# EAGLE schematic controller_board (EAGLE 7.6.0)
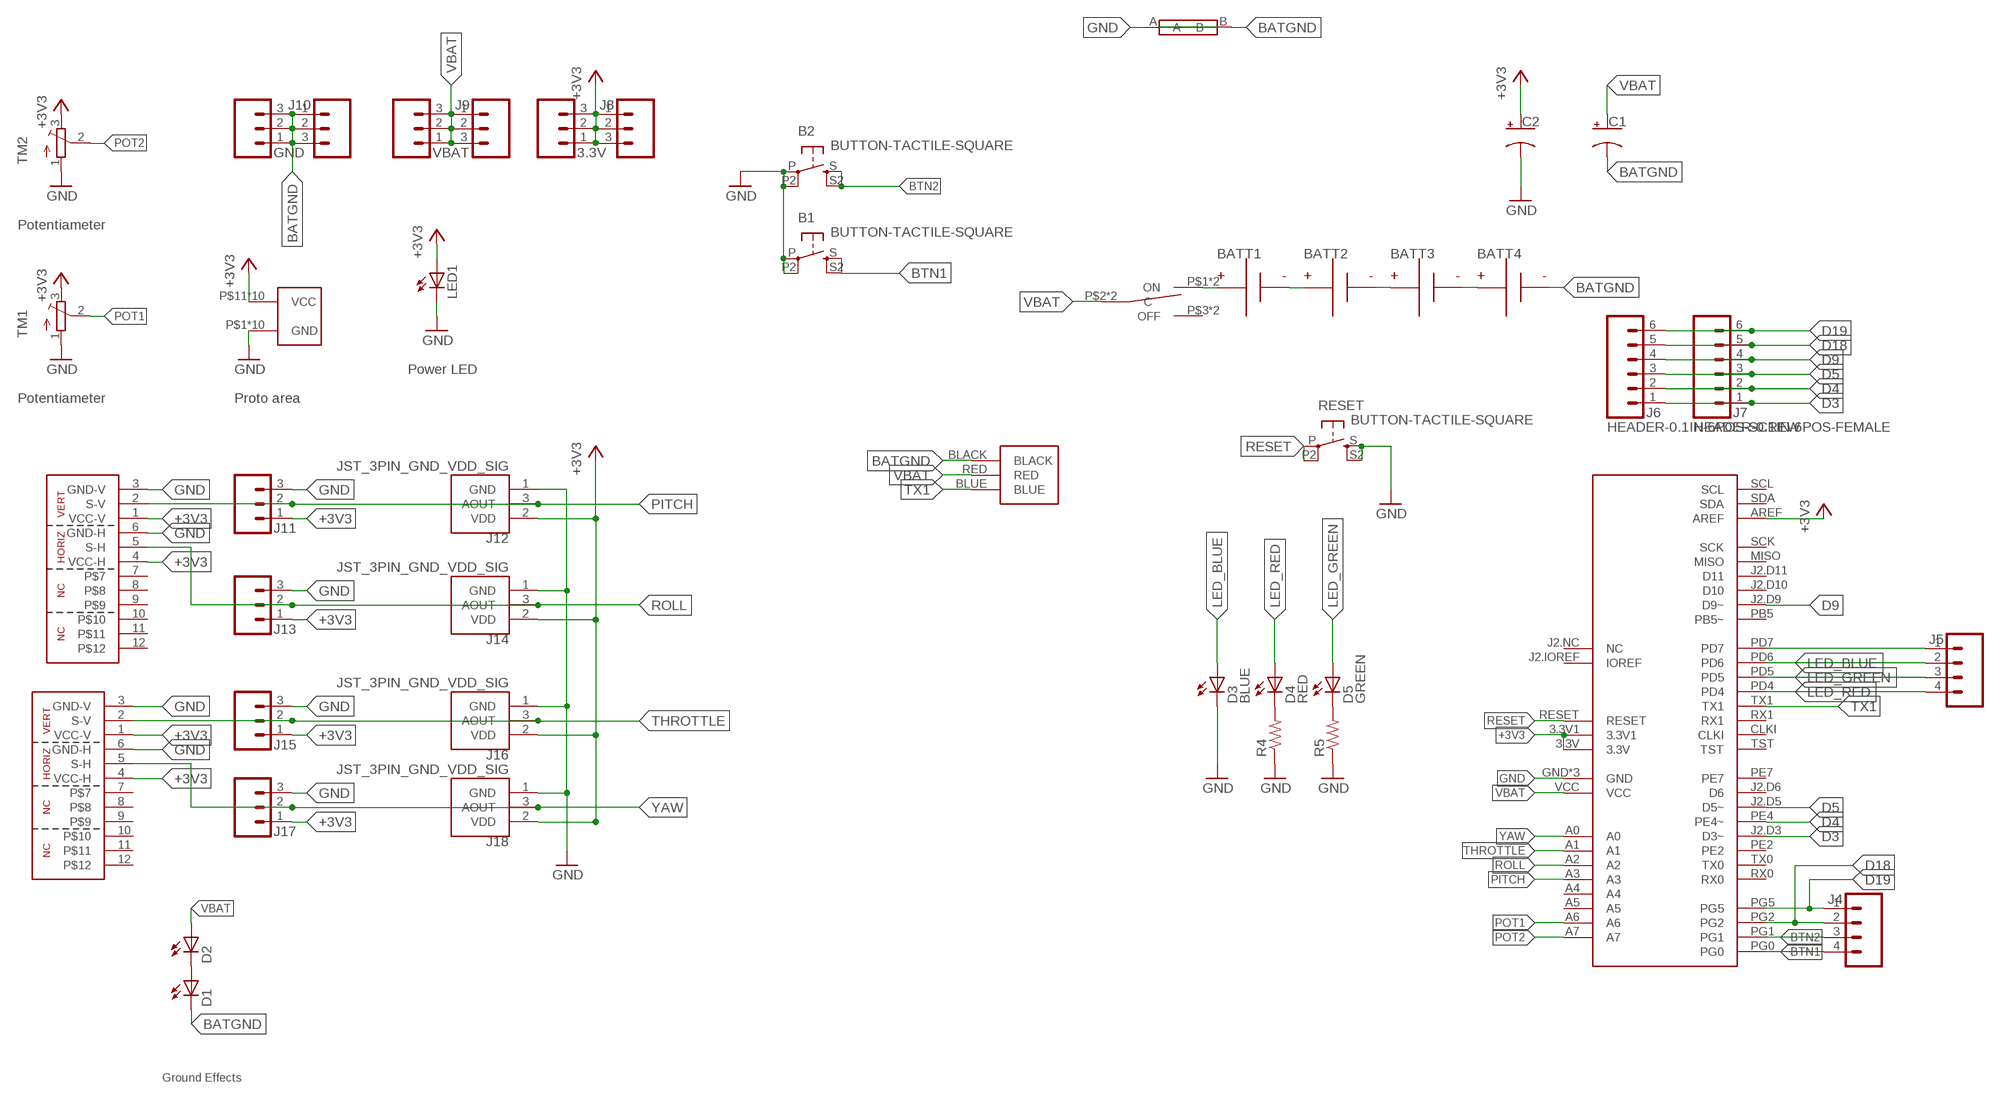
[diagram p0: schematic, sheet 1]

## Parts
3.3V  HEADER-0.1IN-3POS-SCREW  [SCREW-TERMINAL-1X3-2.54MM]
B1  BUTTON-TACTILE-SQUARE  [BUTTON-TACTILE-SQUARE-ADAFRUIT1010]
B2  BUTTON-TACTILE-SQUARE  [BUTTON-TACTILE-SQUARE-ADAFRUIT1010]
BATT1  BATTERY-AA-CLIP  [BATTERY-AA-BK-92]
BATT2  BATTERY-AA-CLIP  [BATTERY-AA-BK-92]
BATT3  BATTERY-AA-CLIP  [BATTERY-AA-BK-92]
BATT4  BATTERY-AA-CLIP  [BATTERY-AA-BK-92]
C1  RESOLVED-CAPACITOR-POL_TH-RADIAL_ALUMINUM_18MM  [CAPPRD750W80D1800H2200P]
C2  RESOLVED-CAPACITOR-POL_TH-RADIAL_ALUMINUM_6.3MM  [CAPPRD250W80D630H1220P]
D1  LED3MM  [LED3MM]
D2  LED3MM  [LED3MM]
D3  BLUE  LED3MM  [LED3MM]
D4  RED  LED3MM  [LED3MM]
D5  GREEN  LED3MM  [LED3MM]
F1  SHORT  [SHORT]
GND  HEADER-0.1IN-3POS-SCREW  [SCREW-TERMINAL-1X3-2.54MM]
J1  FRSKY-GIMBAL  [JST-13-PTH]
J2  FRSKY-GIMBAL  [JST-13-PTH]
J3  WIRE-HARNESS-SPARKFUN-9915  [WIRE-HARNESS-SPARKFUN-9915]
J4  HEADER-0.1IN-4POS-FEMALE  [HDRV4W63P254_4X1_1016X254H838_HS]
J5  HEADER-0.1IN-4POS-FEMALE  [HDRV4W63P254_4X1_1016X254H838_HS]
J6  HEADER-0.1IN-6POS-SCREW  [SCREW-TERMINAL-1X6-2.54MM]
J7  HEADER-0.1IN-6POS-FEMALE  [HDRV6W63P254_6X1_1524X254H838_HS]
J8  HEADER-0.1IN-3POS-FEMALE  [HDRV3W63P254_3X1_762X254H838_HS]
J9  HEADER-0.1IN-3POS-FEMALE  [HDRV3W63P254_3X1_762X254H838_HS]
J10  HEADER-0.1IN-3POS-FEMALE  [HDRV3W63P254_3X1_762X254H838_HS]
J11  HEADER-0.1IN-3POS-SCREW  [SCREW-TERMINAL-1X3-2.54MM]
J12  JST_3PIN_GND_VDD_SIG  [JST-3-PTH-REVERSE]
J13  HEADER-0.1IN-3POS-SCREW  [SCREW-TERMINAL-1X3-2.54MM]
J14  JST_3PIN_GND_VDD_SIG  [JST-3-PTH-REVERSE]
J15  HEADER-0.1IN-3POS-SCREW  [SCREW-TERMINAL-1X3-2.54MM]
J16  JST_3PIN_GND_VDD_SIG  [JST-3-PTH-REVERSE]
J17  HEADER-0.1IN-3POS-SCREW  [SCREW-TERMINAL-1X3-2.54MM]
J18  JST_3PIN_GND_VDD_SIG  [JST-3-PTH-REVERSE]
LED1  LED-5MM-RED  [LED5MM]
R4  RESOLVED-RESISTOR_TH-1/6W-CARBON  [RESAD770W45L370D210_HS]
R5  RESOLVED-RESISTOR_TH-1/6W-CARBON  [RESAD770W45L370D210_HS]
RESET  BUTTON-TACTILE-SQUARE  [BUTTON-TACTILE-SQUARE-ADAFRUIT1010]
S1  POWER-SWITCH-MFS201N-9-Z  [POWER-SWITCH-MFS201N-9-Z]
TM1  TRIMPOT3386  [TRIM-3386]
TM2  TRIMPOT3386  [TRIM-3386]
U$3  PROTO-AREA-10X10  [PROTO-AREA-10X10]
U$4  ATMEGA128RFA1-BOB  [ATMEGA128RFA1]
VBAT  HEADER-0.1IN-3POS-SCREW  [SCREW-TERMINAL-1X3-2.54MM]

## Nets
+3V3: 3.3V.1 3.3V.2 3.3V.3 C2.1(+) J1.1(VCC-V) J1.4(VCC-H) J2.1(VCC-V) J2.4(VCC-H) J8.1 J8.2 J8.3 J11.1 J12.2(VDD) J13.1 J14.2(VDD) J15.1 J16.2(VDD) J17.1 J18.2(VDD) LED1.A TM1.3(E) TM2.3(E) U$3.P$11(VCC) U$3.P$12(VCC) U$3.P$13(VCC) U$3.P$14(VCC) U$3.P$15(VCC) U$3.P$16(VCC) U$3.P$17(VCC) U$3.P$18(VCC) U$3.P$19(VCC) U$3.P$20(VCC) U$4.3.3V U$4.3.3V1 U$4.AREF
BATGND [HIGH-I]: BATT4.N1(N) BATT4.N2(N) C1.2(-) D1.K(C) F1.B GND.1 GND.2 GND.3 J3.BLACK J10.1 J10.2 J10.3
BTN1: B1.S B1.S2(S1) J4.4 U$4.PG0
BTN2: B2.S B2.S2(S1) J4.3 U$4.PG1
D3: J6.1 J7.1 U$4.J2.D3(D3~)
D4: J6.2 J7.2 U$4.PE4(PE4~)
D5: J6.3 J7.3 U$4.J2.D5(D5~)
D9: J6.4 J7.4 U$4.J2.D9(D9~)
D18: J4.2 J6.5 J7.5 U$4.PG2
D19: J4.1 J6.6 J7.6 U$4.PG5
GND: B1.P B1.P2(P1) B2.P B2.P2(P1) C2.2(-) D3.K(C) F1.A J1.3(GND-V) J1.6(GND-H) J2.3(GND-V) J2.6(GND-H) J11.3 J12.1(GND) J13.3 J14.1(GND) J15.3 J16.1(GND) J17.3 J18.1(GND) LED1.K(C) R4.1 R5.1 RESET.S RESET.S2(S1) TM1.1(A) TM2.1(A) U$3.P$1(GND) U$3.P$2(GND) U$3.P$3(GND) U$3.P$4(GND) U$3.P$5(GND) U$3.P$6(GND) U$3.P$7(GND) U$3.P$8(GND) U$3.P$9(GND) U$3.P$10(GND) U$4.GND U$4.GND1(GND) U$4.GND2(GND)
LED_BLUE: D3.A J5.2 U$4.PD6
LED_GREEN: D5.A J5.3 U$4.PD5
LED_RED: D4.A J5.4 U$4.PD4
N$1 [HIGH-I]: BATT1.N1(N) BATT1.N2(N) BATT2.P1(P) BATT2.P2(P)
N$2 [HIGH-I]: BATT2.N1(N) BATT2.N2(N) BATT3.P1(P) BATT3.P2(P)
N$3 [HIGH-I]: BATT3.N1(N) BATT3.N2(N) BATT4.P1(P) BATT4.P2(P)
N$4: D4.K(C) R4.2
N$5 [HIGH-I]: BATT1.P1(P) BATT1.P2(P) S1.P$1(ON) S1.P$4(ON)
N$6: D5.K(C) R5.2
N$9: J5.1 U$4.PD7
N$13: D1.A D2.K(C)
PITCH: J1.2(S-V) J11.2 J12.3(AOUT) U$4.A3
POT1: TM1.2(S) U$4.A6
POT2: TM2.2(S) U$4.A7
RESET: RESET.P RESET.P2(P1) U$4.RESET
ROLL: J1.5(S-H) J13.2 J14.3(AOUT) U$4.A2
THROTTLE: J2.2(S-V) J15.2 J16.3(AOUT) U$4.A1
TX1: J3.BLUE U$4.TX1
VBAT [HIGH-I]: C1.1(+) D2.A J3.RED J9.1 J9.2 J9.3 S1.P$2(C) S1.P$5(C) U$4.VCC VBAT.1 VBAT.2 VBAT.3
YAW: J2.5(S-H) J17.2 J18.3(AOUT) U$4.A0
Unconnected: J1.7 J1.8 J1.9 J1.10 J1.11 J1.12 J2.7 J2.8 J2.9 J2.10 J2.11 J2.12 S1.P$3(OFF) S1.P$6(OFF) U$4.A4 U$4.A5 U$4.CLKI U$4.J2.D6(D6) U$4.J2.D10(D10) U$4.J2.D11(D11) U$4.J2.IOREF(IOREF) U$4.J2.NC(NC) U$4.MISO U$4.PB5(PB5~) U$4.PE2 U$4.PE7 U$4.RX0 U$4.RX1 U$4.SCK U$4.SCL U$4.SDA U$4.TST U$4.TX0

## Notes on the sheet
- Potentiameter
- Power LED
- Potentiameter | Proto area
- Ground Effects

## Library data of the parts
3.3V GND VBAT = Components:HEADER-0.1IN-3POS: 3 pin single inline pin header, socket, or connector; DIST: digikey; DISTPN: ED10562-ND
B1 B2 RESET = Controller:BUTTON-TACTILE; DIST: ADAFRUIT; DISTPN: 1010; MISC: temp
BATT1-BATT4 = Components:BATTERY; DIST: Digikey; DISTPN: BK-92-ND; QTY: 2; ROUGH_HEIGHT: 16
C1 = KoalaBuild:RESOLVED-CAPACITOR-POL_: Polarized capacitor; DIST: Digikey; DISTPN: P5158-ND
C2 = KoalaBuild:RESOLVED-CAPACITOR-POL_: Polarized capacitor; DIST: Digikey; DISTPN: P5152-ND
D1-D3 = Components:LED: LED OSRAM: - CHIPLED LG R971, LG N971, LY N971, LG Q971, LY Q971, LO R971, LY R971 LH N974, LH R974 LS Q976, LO Q976, LY Q976 LO Q996 - Hyper CHIPLED LW Q18S LB Q993, LB Q99A, LB R99A - SideLED LS A670, LO A670, LY A670, LG A670, LP A670 LB A673, LV A673, LT A673, LW A673 LH A674 LY A675 LS A676, LA A676, LO A676, LY A676, LW A676 LS A679, LY A679, LG A679 - Hyper Micro SIDELED® LS Y876, LA Y876, LO Y876, LY Y876 LT Y87S - SmartLED LW L88C, LW L88S LB L89C, LB L89S, LG L890 LS L89K, LO L89K, LY L89K LS L896, LA L896, LO L896, LY L896 - TOPLED LS T670, LO T670, LY T670, LG T670, LP T670 LSG T670, LSP T670, LSY T670, LOP T670, LYG T670 LG T671, LOG T671, LSG T671 LB T673, LV T673, LT T673, LW T673 LH T674 LS T676, LA T676, LO T676, LY T676, LB T676, LH T676, LSB T676, LW T676 LB T67C, LV T67C, LT T67C, LS T67K, LO T67K, LY T67K, LW E67C LS E67B, LA E67B, LO E67B, LY E67B, LB E67C, LV E67C, LT E67C LW T67C LS T679, LY T679, LG T679 LS T770, LO T770, LY T770, LG T770, LP T770 LB T773, LV T773, LT T773, LW T773 LH T774 LS E675, LA E675, LY E675, LS T675 LS T776, LA T776, LO T776, LY T776, LB T776 LHGB T686 LT T68C, LB T68C - Hyper Mini TOPLED® LB M676 - Mini TOPLED Santana® LG M470 LS M47K, LO M47K, LY M47K Source: http://www.osram.convergy.de/; DIST: Adafruit; DISTPN: 780
D4 = Components:LED: LED OSRAM: - CHIPLED LG R971, LG N971, LY N971, LG Q971, LY Q971, LO R971, LY R971 LH N974, LH R974 LS Q976, LO Q976, LY Q976 LO Q996 - Hyper CHIPLED LW Q18S LB Q993, LB Q99A, LB R99A - SideLED LS A670, LO A670, LY A670, LG A670, LP A670 LB A673, LV A673, LT A673, LW A673 LH A674 LY A675 LS A676, LA A676, LO A676, LY A676, LW A676 LS A679, LY A679, LG A679 - Hyper Micro SIDELED® LS Y876, LA Y876, LO Y876, LY Y876 LT Y87S - SmartLED LW L88C, LW L88S LB L89C, LB L89S, LG L890 LS L89K, LO L89K, LY L89K LS L896, LA L896, LO L896, LY L896 - TOPLED LS T670, LO T670, LY T670, LG T670, LP T670 LSG T670, LSP T670, LSY T670, LOP T670, LYG T670 LG T671, LOG T671, LSG T671 LB T673, LV T673, LT T673, LW T673 LH T674 LS T676, LA T676, LO T676, LY T676, LB T676, LH T676, LSB T676, LW T676 LB T67C, LV T67C, LT T67C, LS T67K, LO T67K, LY T67K, LW E67C LS E67B, LA E67B, LO E67B, LY E67B, LB E67C, LV E67C, LT E67C LW T67C LS T679, LY T679, LG T679 LS T770, LO T770, LY T770, LG T770, LP T770 LB T773, LV T773, LT T773, LW T773 LH T774 LS E675, LA E675, LY E675, LS T675 LS T776, LA T776, LO T776, LY T776, LB T776 LHGB T686 LT T68C, LB T68C - Hyper Mini TOPLED® LB M676 - Mini TOPLED Santana® LG M470 LS M47K, LO M47K, LY M47K Source: http://www.osram.convergy.de/; DIST: Adafruit; DISTPN: 777
D5 = Components:LED: LED OSRAM: - CHIPLED LG R971, LG N971, LY N971, LG Q971, LY Q971, LO R971, LY R971 LH N974, LH R974 LS Q976, LO Q976, LY Q976 LO Q996 - Hyper CHIPLED LW Q18S LB Q993, LB Q99A, LB R99A - SideLED LS A670, LO A670, LY A670, LG A670, LP A670 LB A673, LV A673, LT A673, LW A673 LH A674 LY A675 LS A676, LA A676, LO A676, LY A676, LW A676 LS A679, LY A679, LG A679 - Hyper Micro SIDELED® LS Y876, LA Y876, LO Y876, LY Y876 LT Y87S - SmartLED LW L88C, LW L88S LB L89C, LB L89S, LG L890 LS L89K, LO L89K, LY L89K LS L896, LA L896, LO L896, LY L896 - TOPLED LS T670, LO T670, LY T670, LG T670, LP T670 LSG T670, LSP T670, LSY T670, LOP T670, LYG T670 LG T671, LOG T671, LSG T671 LB T673, LV T673, LT T673, LW T673 LH T674 LS T676, LA T676, LO T676, LY T676, LB T676, LH T676, LSB T676, LW T676 LB T67C, LV T67C, LT T67C, LS T67K, LO T67K, LY T67K, LW E67C LS E67B, LA E67B, LO E67B, LY E67B, LB E67C, LV E67C, LT E67C LW T67C LS T679, LY T679, LG T679 LS T770, LO T770, LY T770, LG T770, LP T770 LB T773, LV T773, LT T773, LW T773 LH T774 LS E675, LA E675, LY E675, LS T675 LS T776, LA T776, LO T776, LY T776, LB T776 LHGB T686 LT T68C, LB T68C - Hyper Mini TOPLED® LB M676 - Mini TOPLED Santana® LG M470 LS M47K, LO M47K, LY M47K Source: http://www.osram.convergy.de/; DIST: Adafruit; DISTPN: 779
F1 = RemoteParts:SHORT
J1 = RemoteParts:FRSKY-GIMBAL; CH1: PITCH; CH2: ROLL; DIST: Digikey; DISTPN: A100106-ND
J2 = RemoteParts:FRSKY-GIMBAL; CH1: THR; CH2: YAW; DIST: Digikey; DISTPN: A100106-ND
J3 = RemoteParts:WIRE-HARNESS-SPARKFUN-9915; DIST: Sparkfun; DISTPN: 9915
J4 J5 = Components:HEADER-0.1IN-4POS: 4 pin single inline pin header, socket, or connector; DIST: Digikey; DISTPN: S7002-ND
J6 = Components:HEADER-0.1IN-6POS: 6 pin single inline pin header, socket, or connector; DIST: Digikey; DISTPN: ED10565-ND; PIN1: D3; PIN2: D4; PIN3: D5; PIN4: D9; PIN5: D18; PIN6: D19
J7 = Components:HEADER-0.1IN-6POS: 6 pin single inline pin header, socket, or connector; DIST: MISSING; DISTPN: MISSING
J8-J10 = Components:HEADER-0.1IN-3POS: 3 pin single inline pin header, socket, or connector; DIST: Digikey; DISTPN: S7002-ND; PIN1: 1; PIN2: 2; PIN3: 3
J11 J13 J15 J17 = Components:HEADER-0.1IN-3POS: 3 pin single inline pin header, socket, or connector; DIST: digikey; DISTPN: ED10562-ND; PIN1: +; PIN2: A; PIN3: -
J12 J14 J16 J18 = RemoteParts:JST_3PIN_GND_VDD_SIG; DIST: DIGIKEY; DISTPN: A100097-ND
LED1 = Components:LED: LED OSRAM: - CHIPLED LG R971, LG N971, LY N971, LG Q971, LY Q971, LO R971, LY R971 LH N974, LH R974 LS Q976, LO Q976, LY Q976 LO Q996 - Hyper CHIPLED LW Q18S LB Q993, LB Q99A, LB R99A - SideLED LS A670, LO A670, LY A670, LG A670, LP A670 LB A673, LV A673, LT A673, LW A673 LH A674 LY A675 LS A676, LA A676, LO A676, LY A676, LW A676 LS A679, LY A679, LG A679 - Hyper Micro SIDELED® LS Y876, LA Y876, LO Y876, LY Y876 LT Y87S - SmartLED LW L88C, LW L88S LB L89C, LB L89S, LG L890 LS L89K, LO L89K, LY L89K LS L896, LA L896, LO L896, LY L896 - TOPLED LS T670, LO T670, LY T670, LG T670, LP T670 LSG T670, LSP T670, LSY T670, LOP T670, LYG T670 LG T671, LOG T671, LSG T671 LB T673, LV T673, LT T673, LW T673 LH T674 LS T676, LA T676, LO T676, LY T676, LB T676, LH T676, LSB T676, LW T676 LB T67C, LV T67C, LT T67C, LS T67K, LO T67K, LY T67K, LW E67C LS E67B, LA E67B, LO E67B, LY E67B, LB E67C, LV E67C, LT E67C LW T67C LS T679, LY T679, LG T679 LS T770, LO T770, LY T770, LG T770, LP T770 LB T773, LV T773, LT T773, LW T773 LH T774 LS E675, LA E675, LY E675, LS T675 LS T776, LA T776, LO T776, LY T776, LB T776 LHGB T686 LT T68C, LB T68C - Hyper Mini TOPLED® LB M676 - Mini TOPLED Santana® LG M470 LS M47K, LO M47K, LY M47K Source: http://www.osram.convergy.de/; DIST: Adafruit; DISTPN: 679; ROUGH_HEIGHT: 13
R4 R5 = KoalaBuild:RESOLVED-RESISTOR_: Resistor; DIST: Digikey; DISTPN: 68EBK-ND
S1 = RemoteParts:POWER-SWITCH-MFS201N-9-Z; DIST: Digikey; DISTPN: 563-1565-ND
TM1 TM2 = RemoteParts:TRIMPOT: SMT trimmer potentiometer part number TC33X http://www.ladyada.net/library/eagle; DIST: Adafruit; DISTPN: 356
U$3 = Components:PROTO-AREA; DIST: Gadgetron; DISTPN: proto-area-10x10; ROUGH_HEIGHT: 15
U$4 = BOBs:ATMEGA128RFA1; DIST: Adafruit; DISTPN: 85

## Net classes
1 HIGH-I: width 1.5 mm